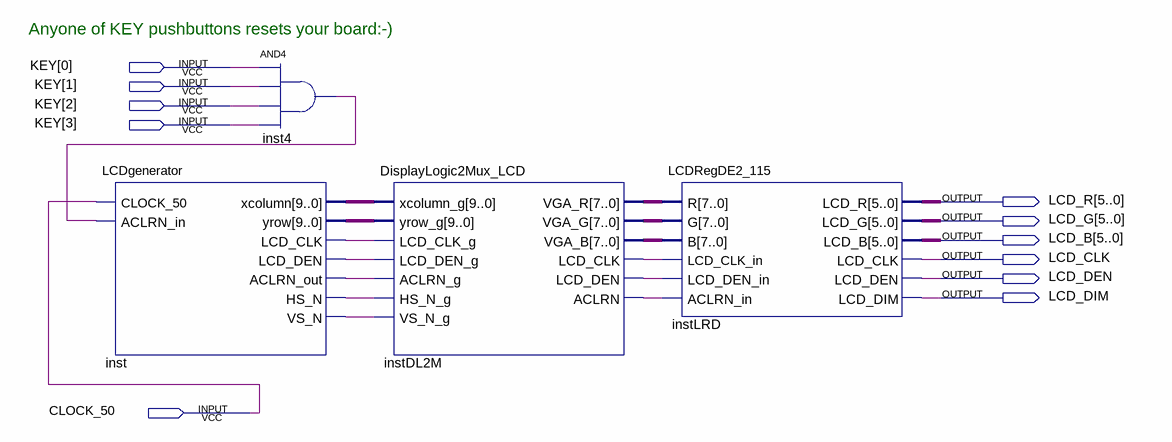
[diagram p0: schematic sheet]
// Quartus schematic DemoMux_LCD.bdf as structural Verilog: 4 symbols, 11 pins
module DemoMux_LCD (
  input  [3:0] KEY,
  input  CLOCK_50,
  output [5:0] LCD_R,
  output [5:0] LCD_G,
  output [5:0] LCD_B,
  output LCD_CLK,
  output LCD_DEN,
  output LCD_DIM
);

  wire inst4_out, inst_aclrn_out, inst_hs_n, inst_lcd_clk, inst_lcd_den, inst_vs_n, instDL2M_aclrn,
       instDL2M_lcd_clk, instDL2M_lcd_den;
  wire [7:0] instDL2M_vga_b, instDL2M_vga_g, instDL2M_vga_r;
  wire [9:0] inst_xcolumn, inst_yrow;

  LCDgenerator inst (
    .CLOCK_50(CLOCK_50), .ACLRN_in(inst4_out), .xcolumn(inst_xcolumn), .yrow(inst_yrow),
    .LCD_CLK(inst_lcd_clk), .LCD_DEN(inst_lcd_den), .ACLRN_out(inst_aclrn_out), .HS_N(inst_hs_n),
    .VS_N(inst_vs_n));
  and inst4 (inst4_out, KEY[0], KEY[1], KEY[2], KEY[3]);
  DisplayLogic2Mux_LCD instDL2M (
    .xcolumn_g(inst_xcolumn), .yrow_g(inst_yrow), .LCD_CLK_g(inst_lcd_clk), .LCD_DEN_g(inst_lcd_den),
    .ACLRN_g(inst_aclrn_out), .HS_N_g(inst_hs_n), .VS_N_g(inst_vs_n), .VGA_R(instDL2M_vga_r),
    .VGA_G(instDL2M_vga_g), .VGA_B(instDL2M_vga_b), .LCD_CLK(instDL2M_lcd_clk), .LCD_DEN(instDL2M_lcd_den),
    .ACLRN(instDL2M_aclrn));
  LCDRegDE2_115 instLRD (
    .R(instDL2M_vga_r), .G(instDL2M_vga_g), .B(instDL2M_vga_b), .LCD_CLK_in(instDL2M_lcd_clk),
    .LCD_DEN_in(instDL2M_lcd_den), .ACLRN_in(instDL2M_aclrn), .LCD_R(LCD_R), .LCD_G(LCD_G), .LCD_B(LCD_B),
    .LCD_CLK(LCD_CLK), .LCD_DEN(LCD_DEN), .LCD_DIM(LCD_DIM));

  // Notes on the sheet:
  //   Anyone of KEY pushbuttons resets your board:-)
endmodule
